# Altium schematic sheet DS3231.SchDoc
size A3; SheetNumber: 4; SheetTotal: 4
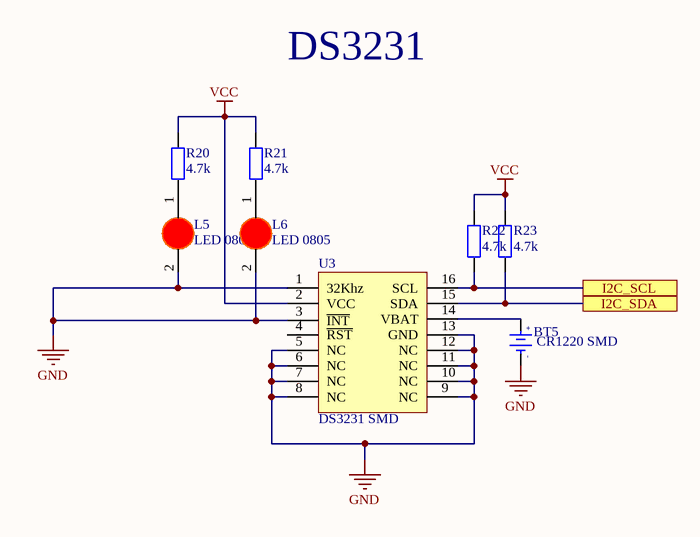
[diagram p0: DS3231.SchDoc]

## Parts
BT5  CR1220 SMD  [DE PIN CR1220]
L5  LED 0805  [LED-0805-Red]
L6  LED 0805  [LED-0805-Red]
R20  4.7k  [tro smd 0603]
R21  4.7k  [tro smd 0603]
R22  4.7k  [tro smd 0603]
R23  4.7k  [tro smd 0603]
U3  DS3231 SMD  [SOIC 16]

## Ports
I2C_SCL, I2C_SDA

## Nets
GND: BT5.2(GND) L5.2(K) L6.2(K) U3.1(32Khz) U3.3(~{INT}) U3.5(NC) U3.6(NC) U3.7(NC) U3.8(NC) U3.9(NC) U3.10(NC) U3.11(NC) U3.12(NC) U3.13(GND)
VCC: R20.2 R21.2 R22.2 R23.2 U3.2(VCC)
I2C_SCL: R22.1 U3.16(SCL) ; port I2C_SCL
I2C_SDA: R23.1 U3.15(SDA) ; port I2C_SDA
NetBT5_1: BT5.1(+3V) U3.14(VBAT)
NetL5_1: L5.1(A) R20.1
NetL6_1: L6.1(A) R21.1

Not connected (* = marked no-connect by the designer): U3 4(~{RST})

## Notes on the sheet
- DS3231
- (in symbol De pin CR1220 SMD) +; -

## Library data of the parts
BT5 = De pin CR1220 SMD: Ten: Đế PIN CR1220 SMD; Ma_Hang: MH000833
L5 L6 = LED 0805 Do: Dán; Don_Vi: Con; Ma_Hang: MH000897; Ten_Linh_Kien: LED 0805 Màu Đỏ (Red); Ghi_Chu: *; Kieu_Chan: *; Chung_Loai: Dán
R20-R23 = Tro 0603 5% 4.7k: Dán; Don_Vi: Con; So_Chan: 2; Ten_Linh_Kien: Trở 0603 5% 4.7k; Ma_Hang: MH006327; Chung_Loai: Dán; Kieu_Chan: *
U3 = DS3231 SMD: SOIC